# Altium schematic sheet VAN_ATTA.SchDoc
size Letter; DrawnBy: Titan Yuan; SheetNumber: 1; SheetTotal: 1
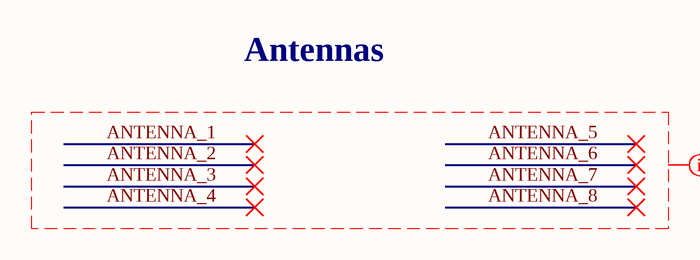
[diagram p0: VAN_ATTA.SchDoc]

## Layout directives
net class 50 Ω: ANTENNA_1, ANTENNA_2, ANTENNA_3, ANTENNA_4, ANTENNA_5, ANTENNA_6, ANTENNA_7, ANTENNA_8

## Notes on the sheet
- Antennas